# EasyEDA Pro project ProPrj_电赛MSPM0公507扩展板_2026-05-01.epro

# Schematic Schematic1
Board Name: Board1; Create Date: 2025-07-27; Page Name: P1; Project Name: 电赛MSPM0公507扩展板; Schematic Name: Schematic1; Update Date: 2025-11-14; Company: 嘉立创EDA; Page Size: A4; Version: V1.0
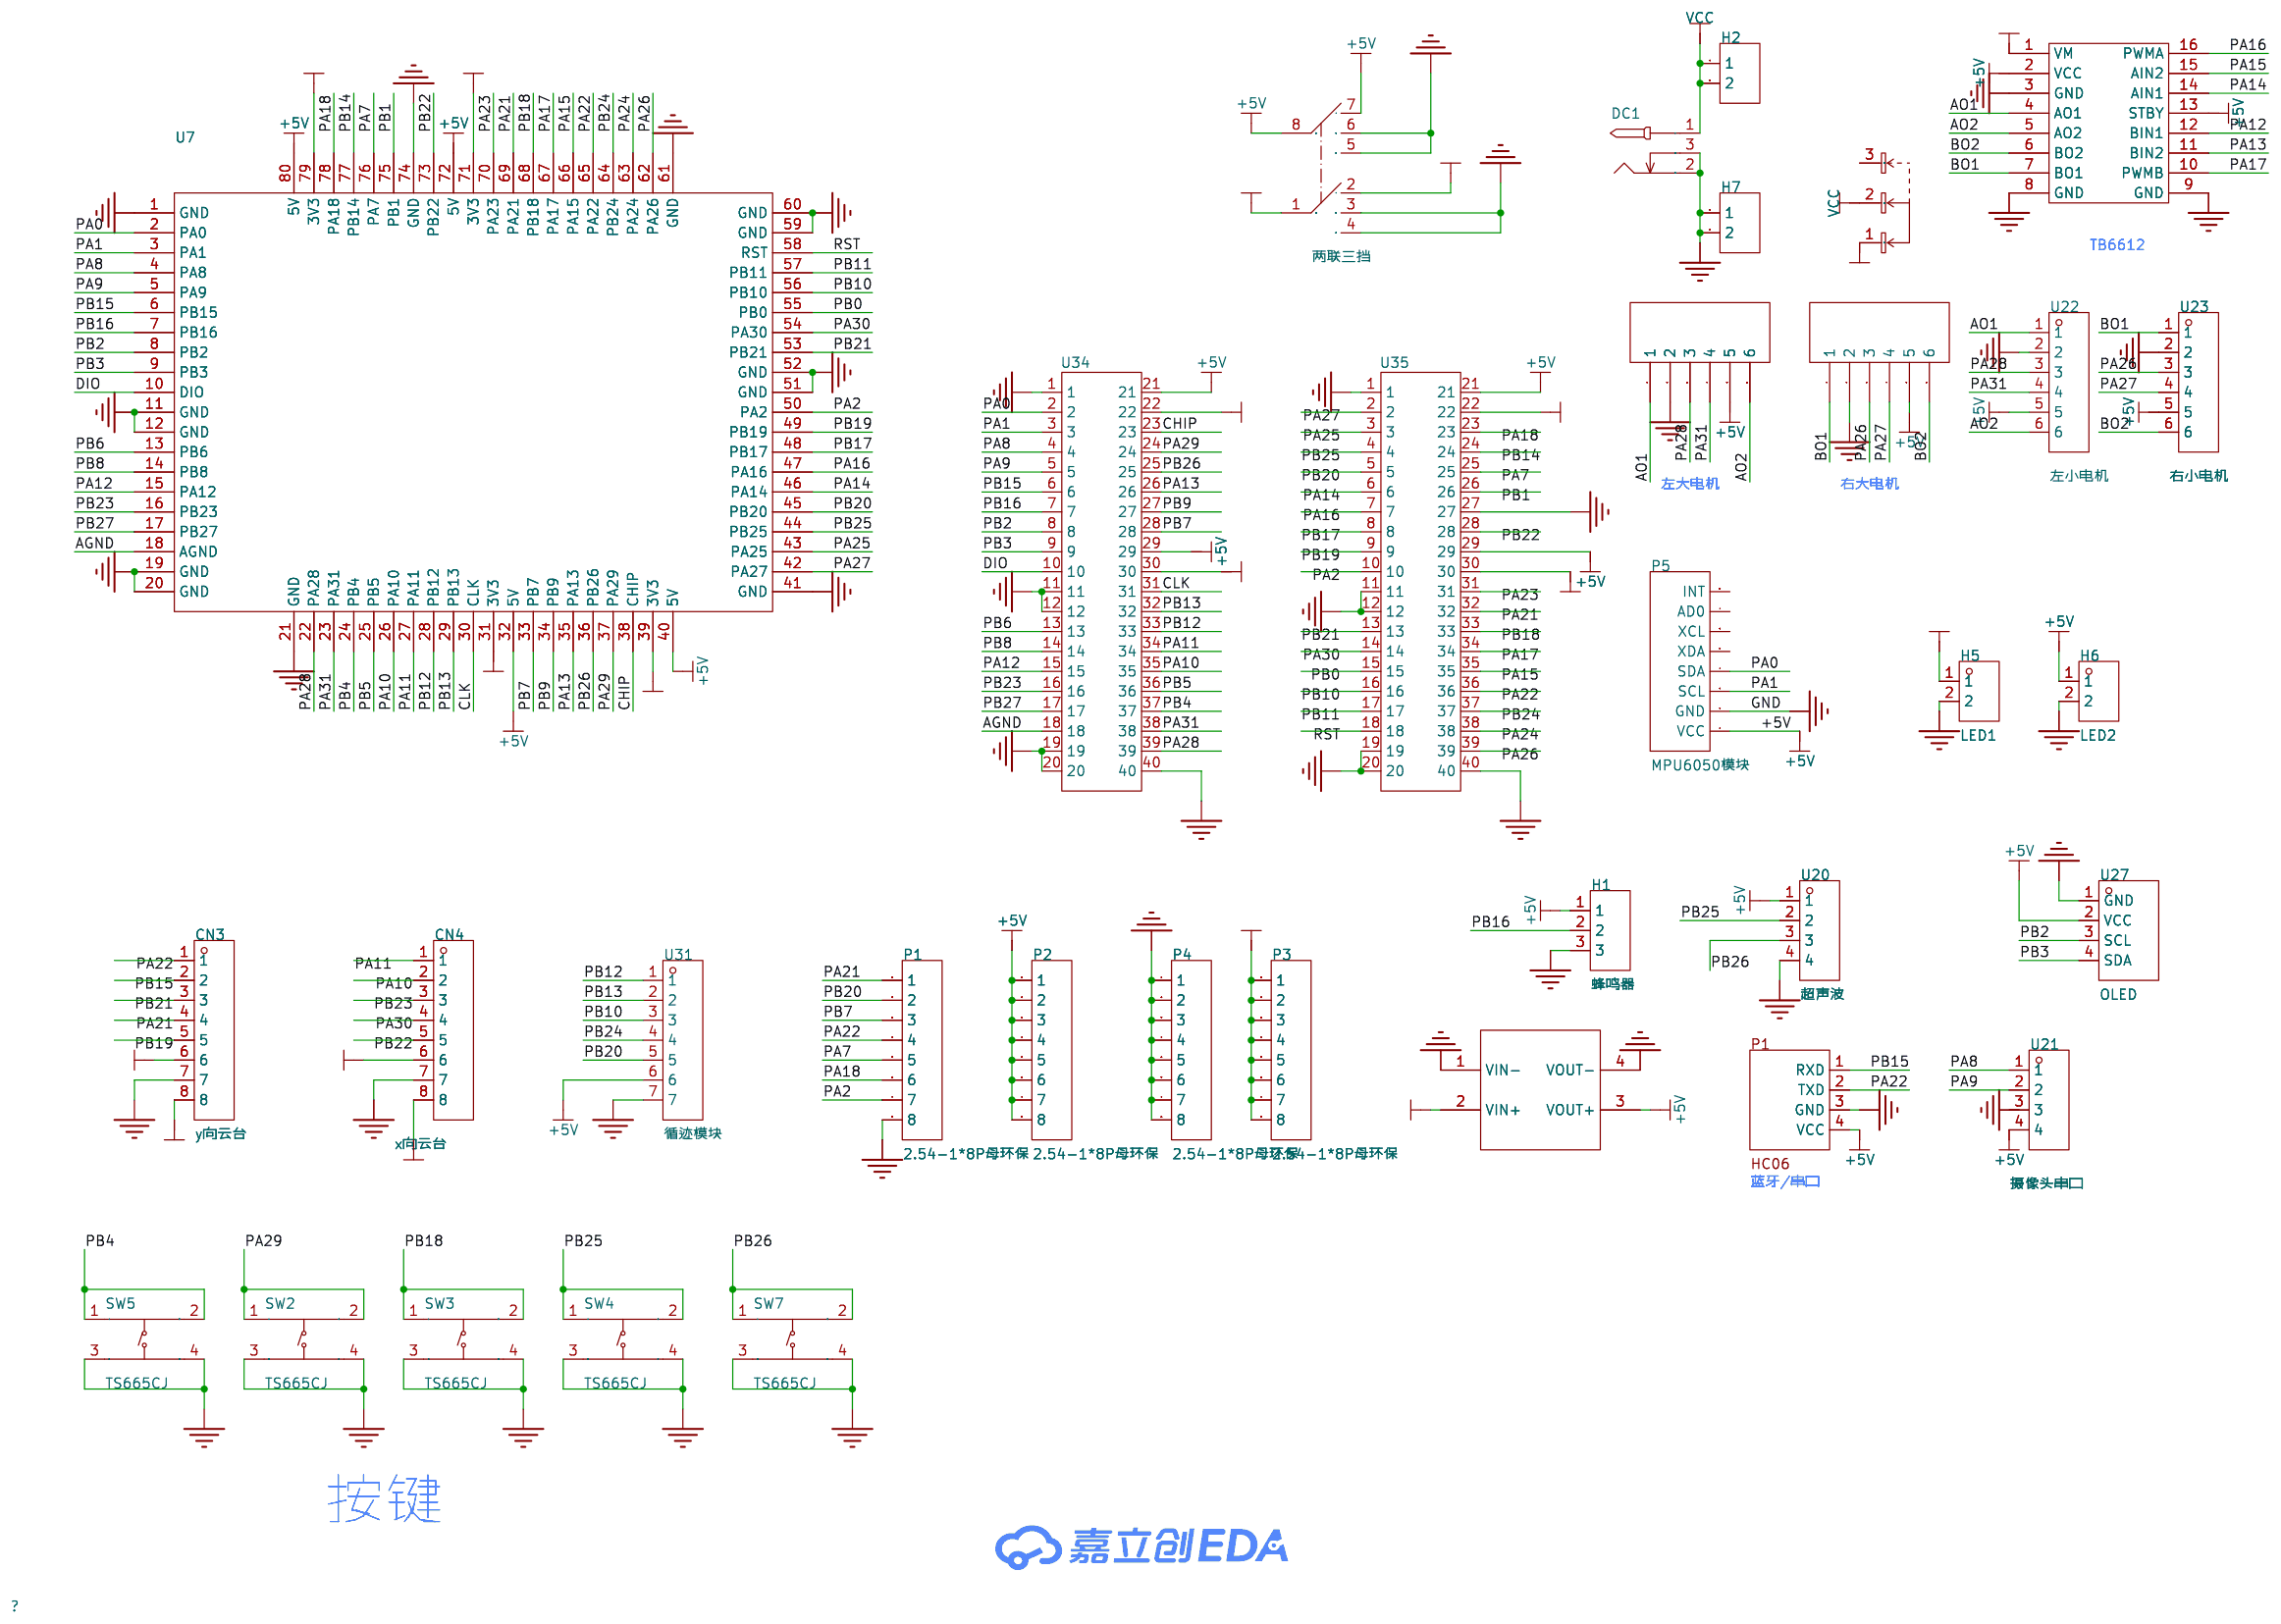
[diagram p0: schematic sheet]

## Parts
CN3  y向云台  [CONN-TH_8P-P2.50-XH2.54-8P]
CN4  x向云台  [CONN-TH_8P-P2.50-XH2.54-8P]
DC1  -  [DC-005_2.5]
H1  蜂鸣器  [HDR-TH_3P-P2.54-V-F]
H2  -  [HDR-TH_2P-P2.54-V-F]
H5  LED1  [HDR-TH_2P-P2.54-V-F]
H6  LED2  [HDR-TH_2P-P2.54-V-F]
H7  -  [HDR-TH_2P-P2.54-V-F]
P1  2.54-1*8P母环保  [HDR-TH_8P-P2.54-V-F-1]
P2  2.54-1*8P母环保  [HDR-TH_8P-P2.54-V-F-1]
P3  2.54-1*8P母环保  [HDR-TH_8P-P2.54-V-F-1]
P4  2.54-1*8P母环保  [HDR-TH_8P-P2.54-V-F-1]
P5  MPU6050模块  [MPU6050模块]
SW1  SS-12D06L5  [SW-TH_3P-P4.70_L11.1-W12.7]
SW2  TS665CJ  [SW-TH_4P-L6.0-W6.0-P4.50-LS6.5]
SW3  TS665CJ  [SW-TH_4P-L6.0-W6.0-P4.50-LS6.5]
SW4  TS665CJ  [SW-TH_4P-L6.0-W6.0-P4.50-LS6.5]
SW5  TS665CJ  [SW-TH_4P-L6.0-W6.0-P4.50-LS6.5]
SW7  TS665CJ  [SW-TH_4P-L6.0-W6.0-P4.50-LS6.5]
SW8  两联三挡  [SW-TH_SS-23D07-GXXX]
U2  TB6612  [TB6612模块]
U4  -  [MP1584EN模块_邮票孔]
U7  -  [嘉立创天猛星]
U13  -  [PH2.0-6]
U14  -  [PH2.0-6]
U17  -  [DIP-1X4P2.54（HC-06蓝牙模块）]
U20  超声波  [HDR-TH_4P-P2.54-V-F]
U21  摄像头串口  [HDR-TH_4P-P2.54-V-F]
U22  左小电机  [CONN-TH_ZH1.5-6AW_C2829757]
U23  右小电机  [CONN-TH_ZH1.5-6AW_C2829757]
U27  OLED  [OLED-TH_L27.8-W27.2-P2.54_C9900033791]
U31  循迹模块  [HDR-TH_7P-P2.54-V-F]
U34  -  [20排针]
U35  -  [20排针]

## Library data of the parts
CN3 CN4 = ZX-XH2.54-8PZZ: 插针结构:1x8P;间距:2.5mm;安装方式:直插;参考系列:XH;总PIN数:8P;排数:1;每排PIN数:8;行距:-;额定电流:3A;触头材质:黄铜;触头镀层:锡;工作温度:-25℃~+85℃;; LCSC Part Name: 1x8P 间距:2.5mm 直插 系列:XH; Supplier Part: C7429638; Manufacturer: Megastar(兆星); Supplier Footprint: 插件,P=2.5mm; JLCPCB Part Class: 扩展库; Datasheet: https://item.szlcsc.com/datasheet/ZX-XH2.54-8PZZ/8427555.html; Supplier: LCSC; Pins Structure: 1x8P; Pitch: 2.5mm; Mounting Type: 直插; Reference Series: XH; Number of Pins: 8P; Number of Rows: 1; Number of PINs Per Row: 8; Current Rating: 3A; Contact Material: 黄铜; Contact Plating: 锡; Operating Temperature: -25℃~+85℃; Voltage Rating: 250V; Plastic Material: PA66; Flame Retardant Rating: UL94V-0; Color: 白色; Z-Height of the Board: 7mm; X-Length of Bottom Edge on Board (Spacing Line): 22.5mm; Y-Width of Bottom Edge on Board: 5.9mm
DC1 = DC-005_2.5: Supplier Footprint: 插件
H1 = PM254V-11-03-H85: 插孔结构:1x3P;间距:2.54mm;行距:-;安装类型:直插;排数:单排;总孔位数:3P;塑高:-;触头材质:黄铜;触头镀层:-;; LCSC Part Name: 间距:2.54mm 1x3P 直插; Supplier Part: C541850; Manufacturer: XFCN(兴飞); Supplier Footprint: 插件,P=2.54mm; JLCPCB Part Class: 扩展库; Datasheet: https://atta.szlcsc.com/upload/public/pdf/source/20200518/C541849_85853D71FC67C51915A806977A588FDA.pdf; Supplier: LCSC; Holes Structure: 1x3P; Pitch: 2.54mm; Mounting Type: 直插; Number of Rows: 单排; Number of Holes: 3P; Contact Material: 黄铜
H2 H7 = HDR-F_2.54_1x2P: Supplier Part: C49661; Supplier Footprint: 插件
H5 H6 = PM254V-11-02-H85: 插孔结构:1x2P;间距:2.54mm;行距:-;安装类型:直插;排数:单排;总孔位数:2P;塑高:-;触头材质:黄铜;触头镀层:-;; LCSC Part Name: 间距:2.54mm 1x2P 直插; Supplier Part: C541849; Manufacturer: XFCN(兴飞); Supplier Footprint: 插件,P=2.54mm; JLCPCB Part Class: 扩展库; Datasheet: https://atta.szlcsc.com/upload/public/pdf/source/20200518/C541849_85853D71FC67C51915A806977A588FDA.pdf; Supplier: LCSC; Holes Structure: 1x2P; Pitch: 2.54mm; Mounting Type: 直插; Number of Rows: 单排; Number of Holes: 2P; Contact Material: 黄铜
P1-P4 = 2.54-1*8P母环保: 排数:单排;总孔位数:8P;间距:2.54mm;插孔结构:1x8P;行距:-;安装类型:直插;塑高:-;触头材质:-;触头镀层:-;; LCSC Part Name: 间距:2.54mm 1x8P 直插; Supplier Part: C27438; Manufacturer: BOOMELE(博穆精密); Supplier Footprint: 插件,P=2.54mm; JLCPCB Part Class: 扩展库; Datasheet: https://atta.szlcsc.com/upload/public/pdf/source/20210301/C2718488_F4427B881E42CAA8DDB0B1C12B3A522C.pdf; Supplier: LCSC; Number of Rows: 单排; Number of Holes: 8P; Pitch: 2.54mm; Holes Structure: 1x8P; Mounting Type: 直插
P5 = MPU6050模块: _: 3
SW1 = SS-12D06L5: 电路结构:单刀双掷;安装方式:侧插;开关颜色:黑色;额定电流(DC):3A;额定电压(DC):250V;额定电流(AC):3A;额定电压(AC):250V;机械寿命:1万次;; LCSC Part Name: 柄长5mm 卧插双档 滑动开关; Supplier Part: C319015; Manufacturer: XKB Connectivity(中国星坤); Supplier Footprint: 插件; JLCPCB Part Class: 扩展库; Datasheet: https://atta.szlcsc.com/upload/public/pdf/source/20211009/0D67854FD60FB1F6FE75130AD47C052C.pdf; Supplier: LCSC; Circuit: 单刀双掷; Actuator Style: 矩形柱状; Pin Style: PC引脚; Switch Length: 12.95mm; Switch Width: 6.6mm; Switch Height: 6.3mm; Mounting Style: 侧插; Actuator Color: 黑色; Current Rating (DC): 3A; Voltage Rating (DC): 250V; Current Rating (AC): 3A; Voltage Rating (AC): 250V; Mechanical Life: 1万次; Operating Temperature: -40℃~+85℃
SW2-SW5 SW7 = TS665CJ: 电路结构:单刀单掷;按钮形状:圆形按钮;安装方式:直插;开关长度:6mm;开关宽度:6mm;开关高度:5mm;触点电流:50mA;额定电压(DC):12V;带灯:-;机械寿命:-;; LCSC Part Name: 6*6*5mm 直插 轻触开关; Supplier Part: C393938; Manufacturer: SHOU HAN(首韩); Supplier Footprint: 插件; JLCPCB Part Class: 扩展库; Datasheet: https://atta.szlcsc.com/upload/public/pdf/source/20190521/C393938_BDABEAC600B4C55E200A80AA129B70BC.pdf; Supplier: LCSC; Circuit: 单刀单掷; Actuator Style: 圆形按钮; Mounting Style: 直插; Switch Length: 6mm; Switch Width: 6mm; Switch Height: 5mm; Contact Current: 50mA; Voltage Rating (DC): 12V
SW8 = 双刀三掷开关: SS-23D07-G060 / 电路结构:双刀三掷;安装方式:直插;开关颜色:黑色;额定电流(DC):1A; / 额定电压(DC):24V;机械寿命:1万次;; LCSC Part Name: 柄长6mm 直插三档 滑动开关; Supplier Part: C2876026; Manufacturer: G-Switch(品赞); Supplier Footprint: 插件; JLCPCB Part Class: 扩展库; Datasheet: https://atta.szlcsc.com/upload/public/pdf/source/20210810/D61593AB5453652CDE8C7ACF23E1586D.pdf; Supplier: LCSC; Circuit: 双刀三掷; Actuator Style: 矩形柱状; Pin Style: PC引脚; Switch Length: 12.7mm; Switch Width: 7.1mm; Switch Height: 10.7mm; Mounting Style: 直插; Actuator Color: 黑色; Current Rating (DC): 1A; Voltage Rating (DC): 24V; Mechanical Life: 1万次; Operating Temperature: -25℃~+70℃
U2 = TB6612模块
U4 = MP1584EN模块: MP1584END电源模块
U7 = 立创天猛星-MSPM0G3507
U13 U14 = PH2.0-6: _: 3
U17 = HC06
U20 U21 = ZX-PM2.54-1-4PY: 插孔结构:1x4P;间距:2.54mm;行距:-;圆孔/方孔:方孔;安装方式:直插;排数:单排;总孔位数:4P;额定电流:3A;额定电压:-;插孔方向:顶部;塑高:8.5mm;触头材质:-;触头镀层:金;工作温度:-40℃~+105℃;; LCSC Part Name: 1x4P 间距:2.54mm 直插; Supplier Part: C7499324; Manufacturer: Megastar(兆星); Supplier Footprint: 插件,P=2.54mm; JLCPCB Part Class: 扩展库; Datasheet: https://atta.szlcsc.com/upload/public/pdf/source/20231122/7B8A8052B709698EED6259902C1E0188.pdf; Supplier: LCSC; Holes Structure: 1x4P; Pitch: 2.54mm; Circular Hole / Square Hole: 方孔; Mounting Type: 直插; Number of Rows: 单排; Number of Positions: 4P; Current Rating: 3A; Holes Direction: 顶部; Insulation Height: 8.5mm; Contact Plating: 金; Operating Temperature: -40℃~+105℃; PIN Length: 3.2mm
U22 U23 = BX-ZH1.5-6PWZ: 插针结构:1x6P;间距:1.5mm;安装方式:弯插;参考系列:ZH;总PIN数:6P;排数:1;每排PIN数:6;行距:-;额定电流:-;触头材质:黄铜;触头镀层:锡;工作温度:-25℃~+85℃;; LCSC Part Name: 1x6P 间距:1.5mm 弯插 系列:ZH; Supplier Part: C18077740; Manufacturer: Bossie(博锡); Supplier Footprint: 弯插,P=1.5mm; JLCPCB Part Class: 扩展库; Datasheet: https://atta.szlcsc.com/upload/public/pdf/source/20231017/5A4E9FE20877BDD2F3FB1D1F8B5EF450.pdf; Supplier: LCSC; Pins Structure: 1x6P; Pitch: 1.5mm; Mounting Type: 弯插; Reference Series: ZH; Number of Pins: 6P; Number of Rows: 1; Number of PINs Per Row: 6; Contact Material: 黄铜; Contact Plating: 锡; Operating Temperature: -25℃~+85℃; Voltage Rating: 250V; Plastic Material: PA66; Color: 白色; Z-Height of the Board: 3.7mm; X-Length of Bottom Edge on Board (Spacing Line): 10.5mm; Y-Width of Bottom Edge on Board: 4.55mm
U27 = HS96L03W2C03: 主控芯片:SSD1315;接口类型:I2C;尺寸(inch):0.96;像素分辨率:128x64;; LCSC Part Name: 0.96寸OLED显示屏窄白光IIC; Supplier Part: C5248080; Manufacturer: HS(汉昇); JLCPCB Part Class: 扩展库; Datasheet: https://atta.szlcsc.com/upload/public/pdf/source/20230627/763D01F79A90007632F098068C7C8AD9.pdf; Supplier: LCSC; Main Control Chip: SSD1315; Interface Type: I2C; Size: 0.96; Pixel Resolution: 128x64; Operating Temperature: -40℃~+70℃
U31 = KH-2.54FH-1X7P-H8.5: 插孔结构:1x7P;间距:2.54mm;行距:-;圆孔/方孔:方孔;安装方式:直插;排数:单排;总孔位数:7P;额定电流:3A;额定电压:-;插孔方向:顶部;塑高:8.5mm;工作温度:-40℃~+105℃;; LCSC Part Name: 间距:2.54mm 1x7P 直插; Supplier Part: C2932672; Manufacturer: kinghelm(金航标); Supplier Footprint: 插件,P=2.54mm; JLCPCB Part Class: 扩展库; Datasheet: https://item.szlcsc.com/datasheet/KH-2.54FH-1X7P-H8.5/3278193.html; Supplier: LCSC; Holes Structure: 1x7P; Pitch: 2.54mm; Circular Hole / Square Hole: 方孔; Mounting Type: 直插; Number of Rows: 单排; Number of Positions: 7P; Current Rating: 3A; Holes Direction: 顶部; Insulation Height: 8.5mm; Operating Temperature: -40℃~+105℃
U34 U35 = 20排针

## Nets
+3.3V: CN3.6 CN4.6 H5.1 U7.31(3V3) U7.39(3V3) U7.71(3V3) U7.79(3V3) U34.22 U34.30 U35.22 U35.30
+5V: H1.1 H6.1 P2.1 P2.2 P2.3 P2.4 P2.5 P2.6 P2.7 P2.8 P5.1(VCC) SW8.7 SW8.8 U2.2(VCC) U2.13(STBY) U4.3(VOUT+) U7.32(5V) U7.40(5V) U7.72(5V) U7.80(5V) U13.5 U14.5 U17.4(VCC) U20.1 U21.4 U22.5 U23.5 U27.2(VCC) U31.6 U34.21 U34.29 U35.21 U35.29
+12V: CN3.8 CN4.8 P3.1 P3.2 P3.3 P3.4 P3.5 P3.6 P3.7 P3.8 SW1.1 SW8.1(8) SW8.2(7) U2.1(VM) U4.2(VIN+)
AGND: U7.18(AGND) U34.18
GND: CN3.7 CN4.7 DC1.2 DC1.3 H1.3 H5.2 H6.2 H7.1 H7.2 P1.8 P4.1 P4.2 P4.3 P4.4 P4.5 P4.6 P4.7 P4.8 P5.2(GND) SW2.3(C) SW2.4(D) SW3.3(C) SW3.4(D) SW4.3(C) SW4.4(D) SW5.3(C) SW5.4(D) SW7.3(C) SW7.4(D) SW8.3(6) SW8.4(5) SW8.5 SW8.6 U2.3(GND) U2.8(GND) U2.9(GND) U4.1(VIN-) U4.4(VOUT-) U7.1(GND) U7.11(GND) U7.12(GND) U7.19(GND) U7.20(GND) U7.21(GND) U7.41(GND) U7.51(GND) U7.52(GND) U7.59(GND) U7.60(GND) U7.61(GND) U7.74(GND) U13.2 U14.2 U17.3(GND) U20.4 U21.3 U22.2 U23.2 U27.1(GND) U31.7 U34.1 U34.11 U34.12 U34.19 U34.20 U34.40 U35.1 U35.11 U35.12 U35.19 U35.20 U35.27 U35.40
VCC: DC1.1(4) H2.1 H2.2 SW1.2
AO1: U2.4(AO1) U13.1 U22.1
AO2: U2.5(AO2) U13.6 U22.6
BO1: U2.7(BO1) U14.1 U23.1
BO2: U2.6(BO2) U14.6 U23.6
CHIP: U7.38(CHIP) U34.23
CLK: U7.30(CLK) U34.31
DIO: U7.10(DIO) U34.10
PA0: P5.4(SDA) U7.2(PA0) U34.2
PA1: P5.3(SCL) U7.3(PA1) U34.3
PA2: P1.7 U7.50(PA2) U35.10
PA7: P1.5 U7.76(PA7) U35.25
PA8: U7.4(PA8) U21.1 U34.4
PA9: U7.5(PA9) U21.2 U34.5
PA10: CN4.2 U7.26(PA10) U34.35
PA11: CN4.1 U7.27(PA11) U34.34
PA12: U2.12(BIN1) U7.15(PA12) U34.15
PA13: U2.11(BIN2) U7.35(PA13) U34.26
PA14: U2.14(AIN1) U7.46(PA14) U35.6
PA15: U2.15(AIN2) U7.66(PA15) U35.35
PA16: U2.16(PWMA) U7.47(PA16) U35.7
PA17: U2.10(PWMB) U7.67(PA17) U35.34
PA18: P1.6 U7.78(PA18) U35.23
PA21: CN3.4 P1.1 U7.69(PA21) U35.32
PA22: CN3.1 P1.4 U7.65(PA22) U17.2(TXD) U35.36
PA23: U7.70(PA23) U35.31
PA24: U7.63(PA24) U35.38
PA25: U7.43(PA25) U35.3
PA26: U7.62(PA26) U14.3 U23.3 U35.39
PA27: U7.42(PA27) U14.4 U23.4 U35.2
PA28: U7.22(PA28) U13.3 U22.3 U34.39
PA29: SW2.1(A) SW2.2(B) U7.37(PA29) U34.24
PA30: CN4.4 U7.54(PA30) U35.14
PA31: U7.23(PA31) U13.4 U22.4 U34.38
PB0: U7.55(PB0) U35.15
PB1: U7.75(PB1) U35.26
PB2: U7.8(PB2) U27.3(SCL) U34.8
PB3: U7.9(PB3) U27.4(SDA) U34.9
PB4: SW5.1(A) SW5.2(B) U7.24(PB4) U34.37
PB5: U7.25(PB5) U34.36
PB6: U7.13(PB6) U34.13
PB7: P1.3 U7.33(PB7) U34.28
PB8: U7.14(PB8) U34.14
PB9: U7.34(PB9) U34.27
PB10: U7.56(PB10) U31.3 U35.16
PB11: U7.57(PB11) U35.17
PB12: U7.28(PB12) U31.1 U34.33
PB13: U7.29(PB13) U31.2 U34.32
PB14: U7.77(PB14) U35.24
PB15: CN3.2 U7.6(PB15) U17.1(RXD) U34.6
PB16: H1.2 U7.7(PB16) U34.7
PB17: U7.48(PB17) U35.8
PB18: SW3.1(A) SW3.2(B) U7.68(PB18) U35.33
PB19: CN3.5 U7.49(PB19) U35.9
PB20: P1.2 U7.45(PB20) U31.5 U35.5
PB21: CN3.3 U7.53(PB21) U35.13
PB22: CN4.5 U7.73(PB22) U35.28
PB23: CN4.3 U7.16(PB23) U34.16
PB24: U7.64(PB24) U31.4 U35.37
PB25: SW4.1(A) SW4.2(B) U7.44(PB25) U20.2 U35.4
PB26: SW7.1(A) SW7.2(B) U7.36(PB26) U20.3 U34.25
PB27: U7.17(PB27) U34.17
RST: U7.58(RST) U35.18

Not connected (* = marked no-connect by the designer): P5 5(XDA) 6(XCL) 7(AD0) 8(INT); SW1 3

## Notes on the sheet
- TB6612
- 左大电机
- 右大电机
- 蓝牙/串口
- 按键

# Board PCB1
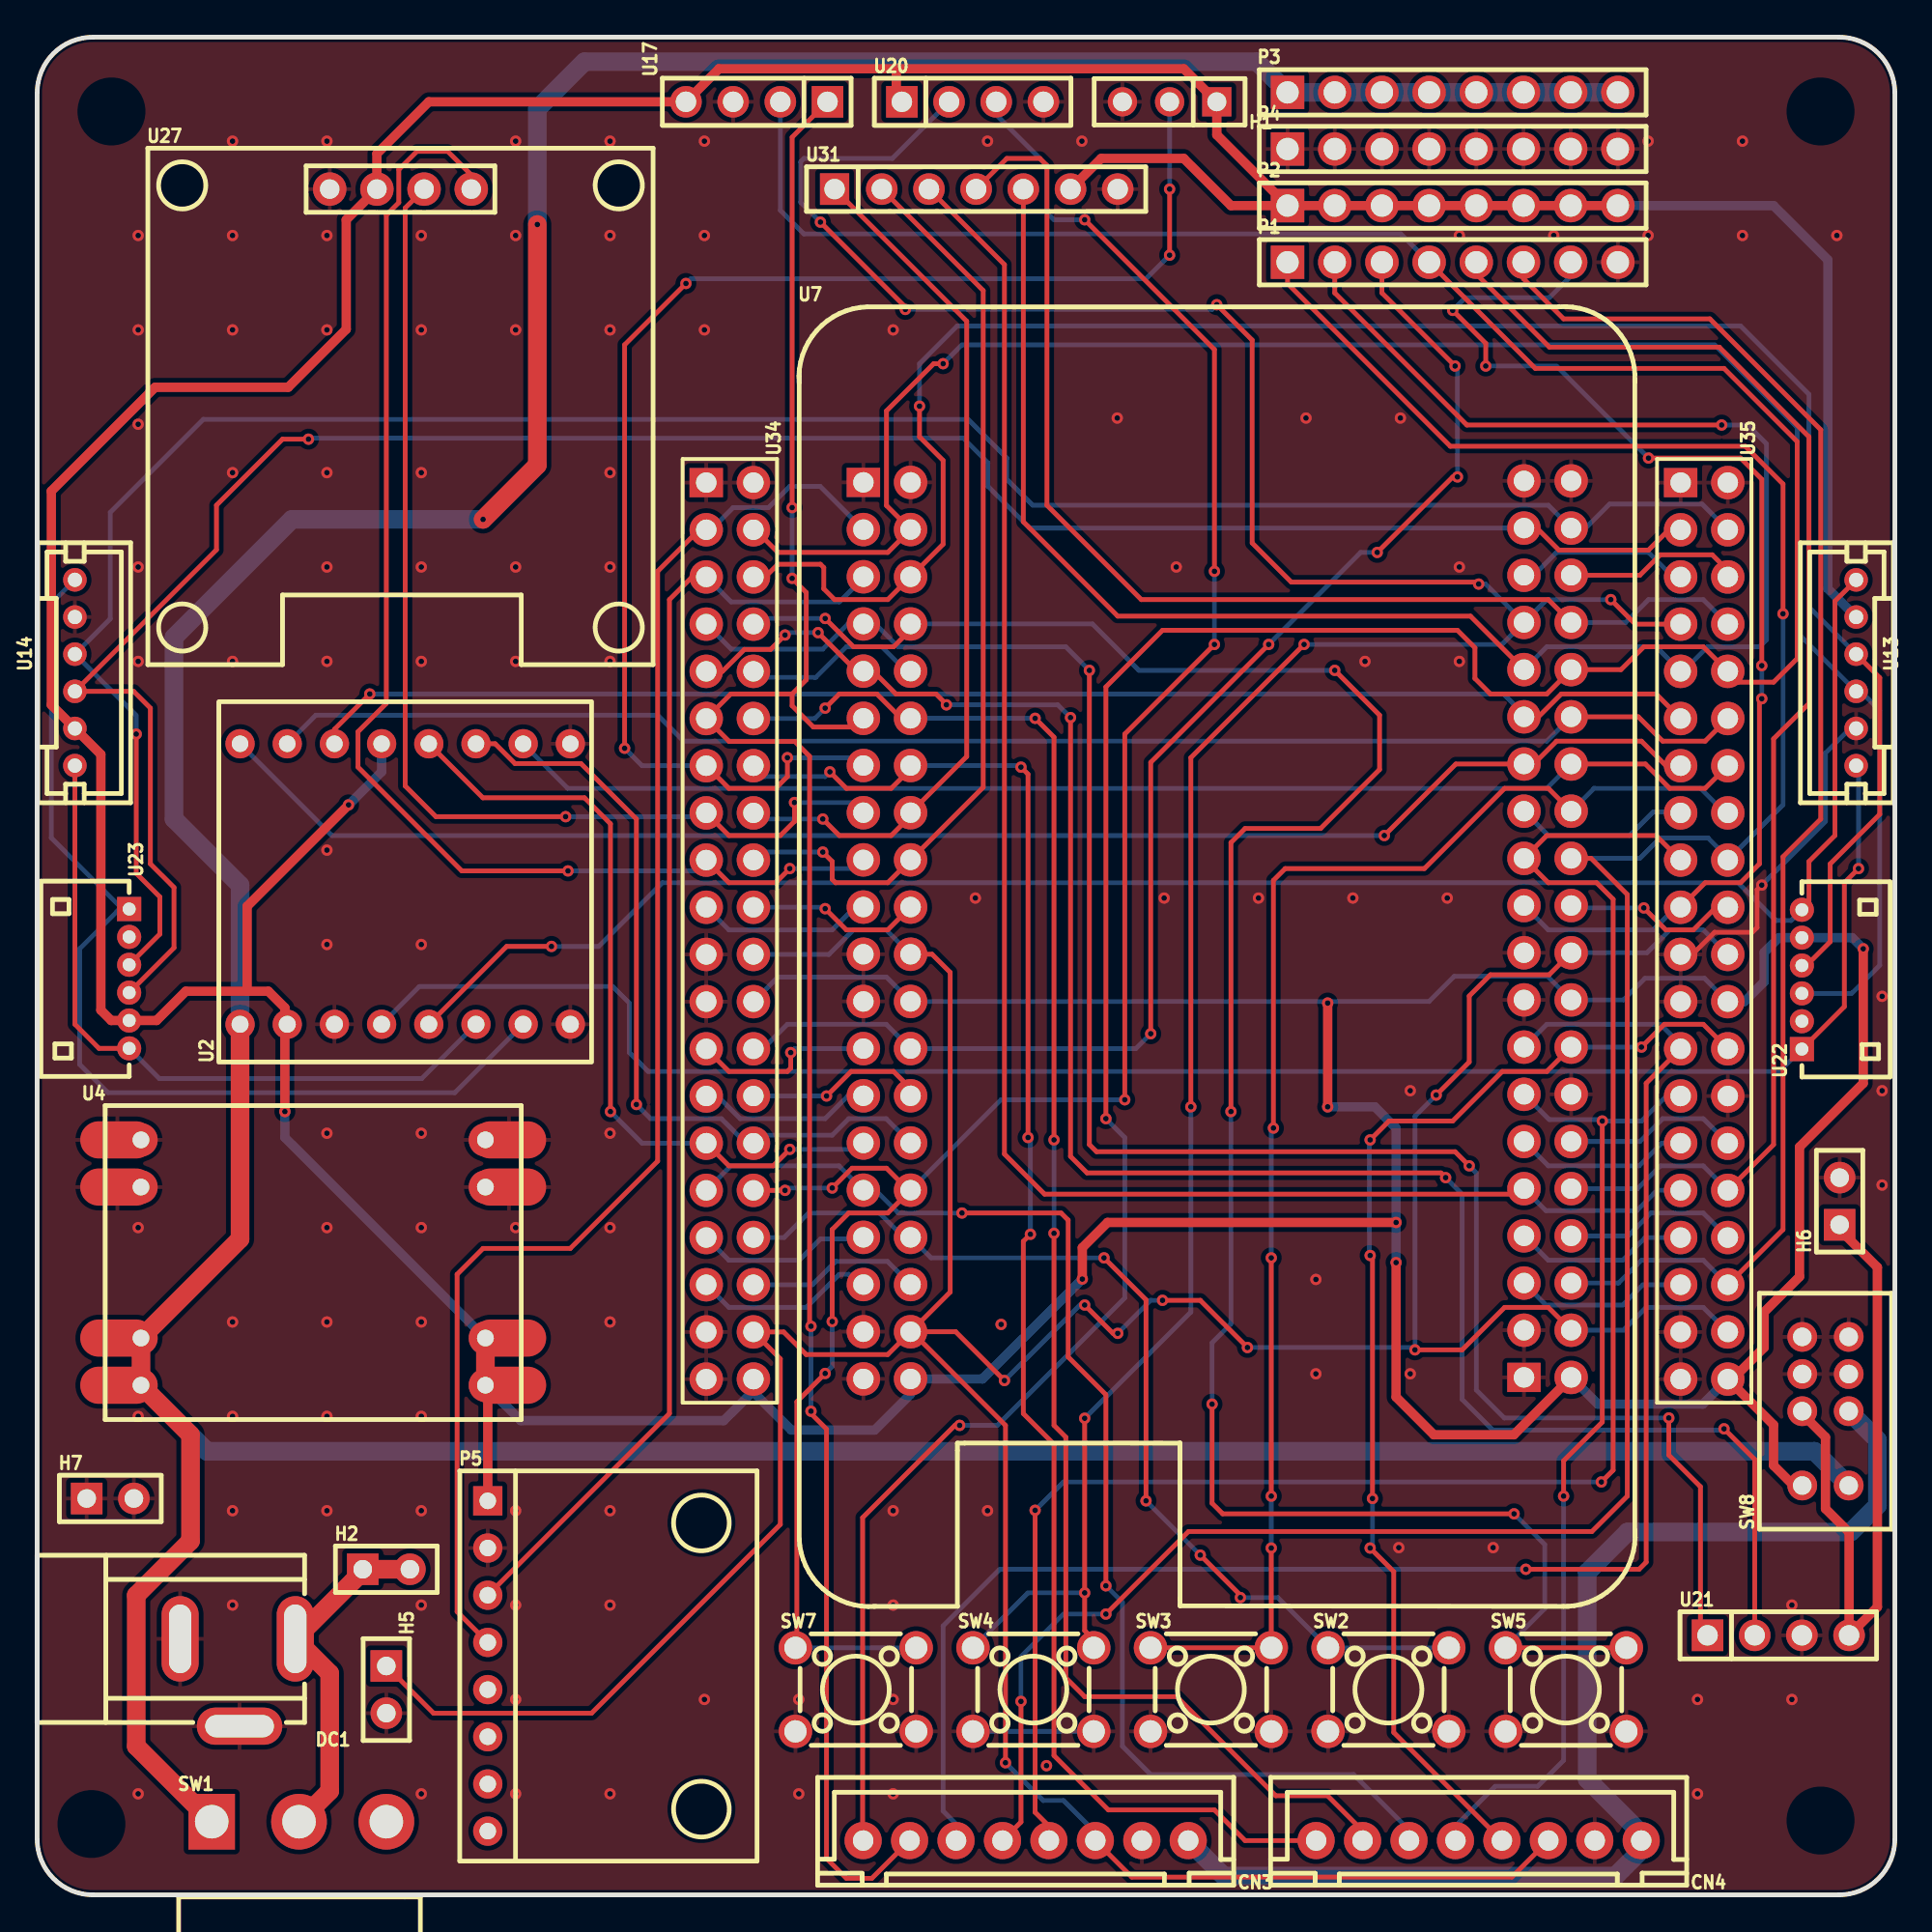
[diagram p1: board, top side]
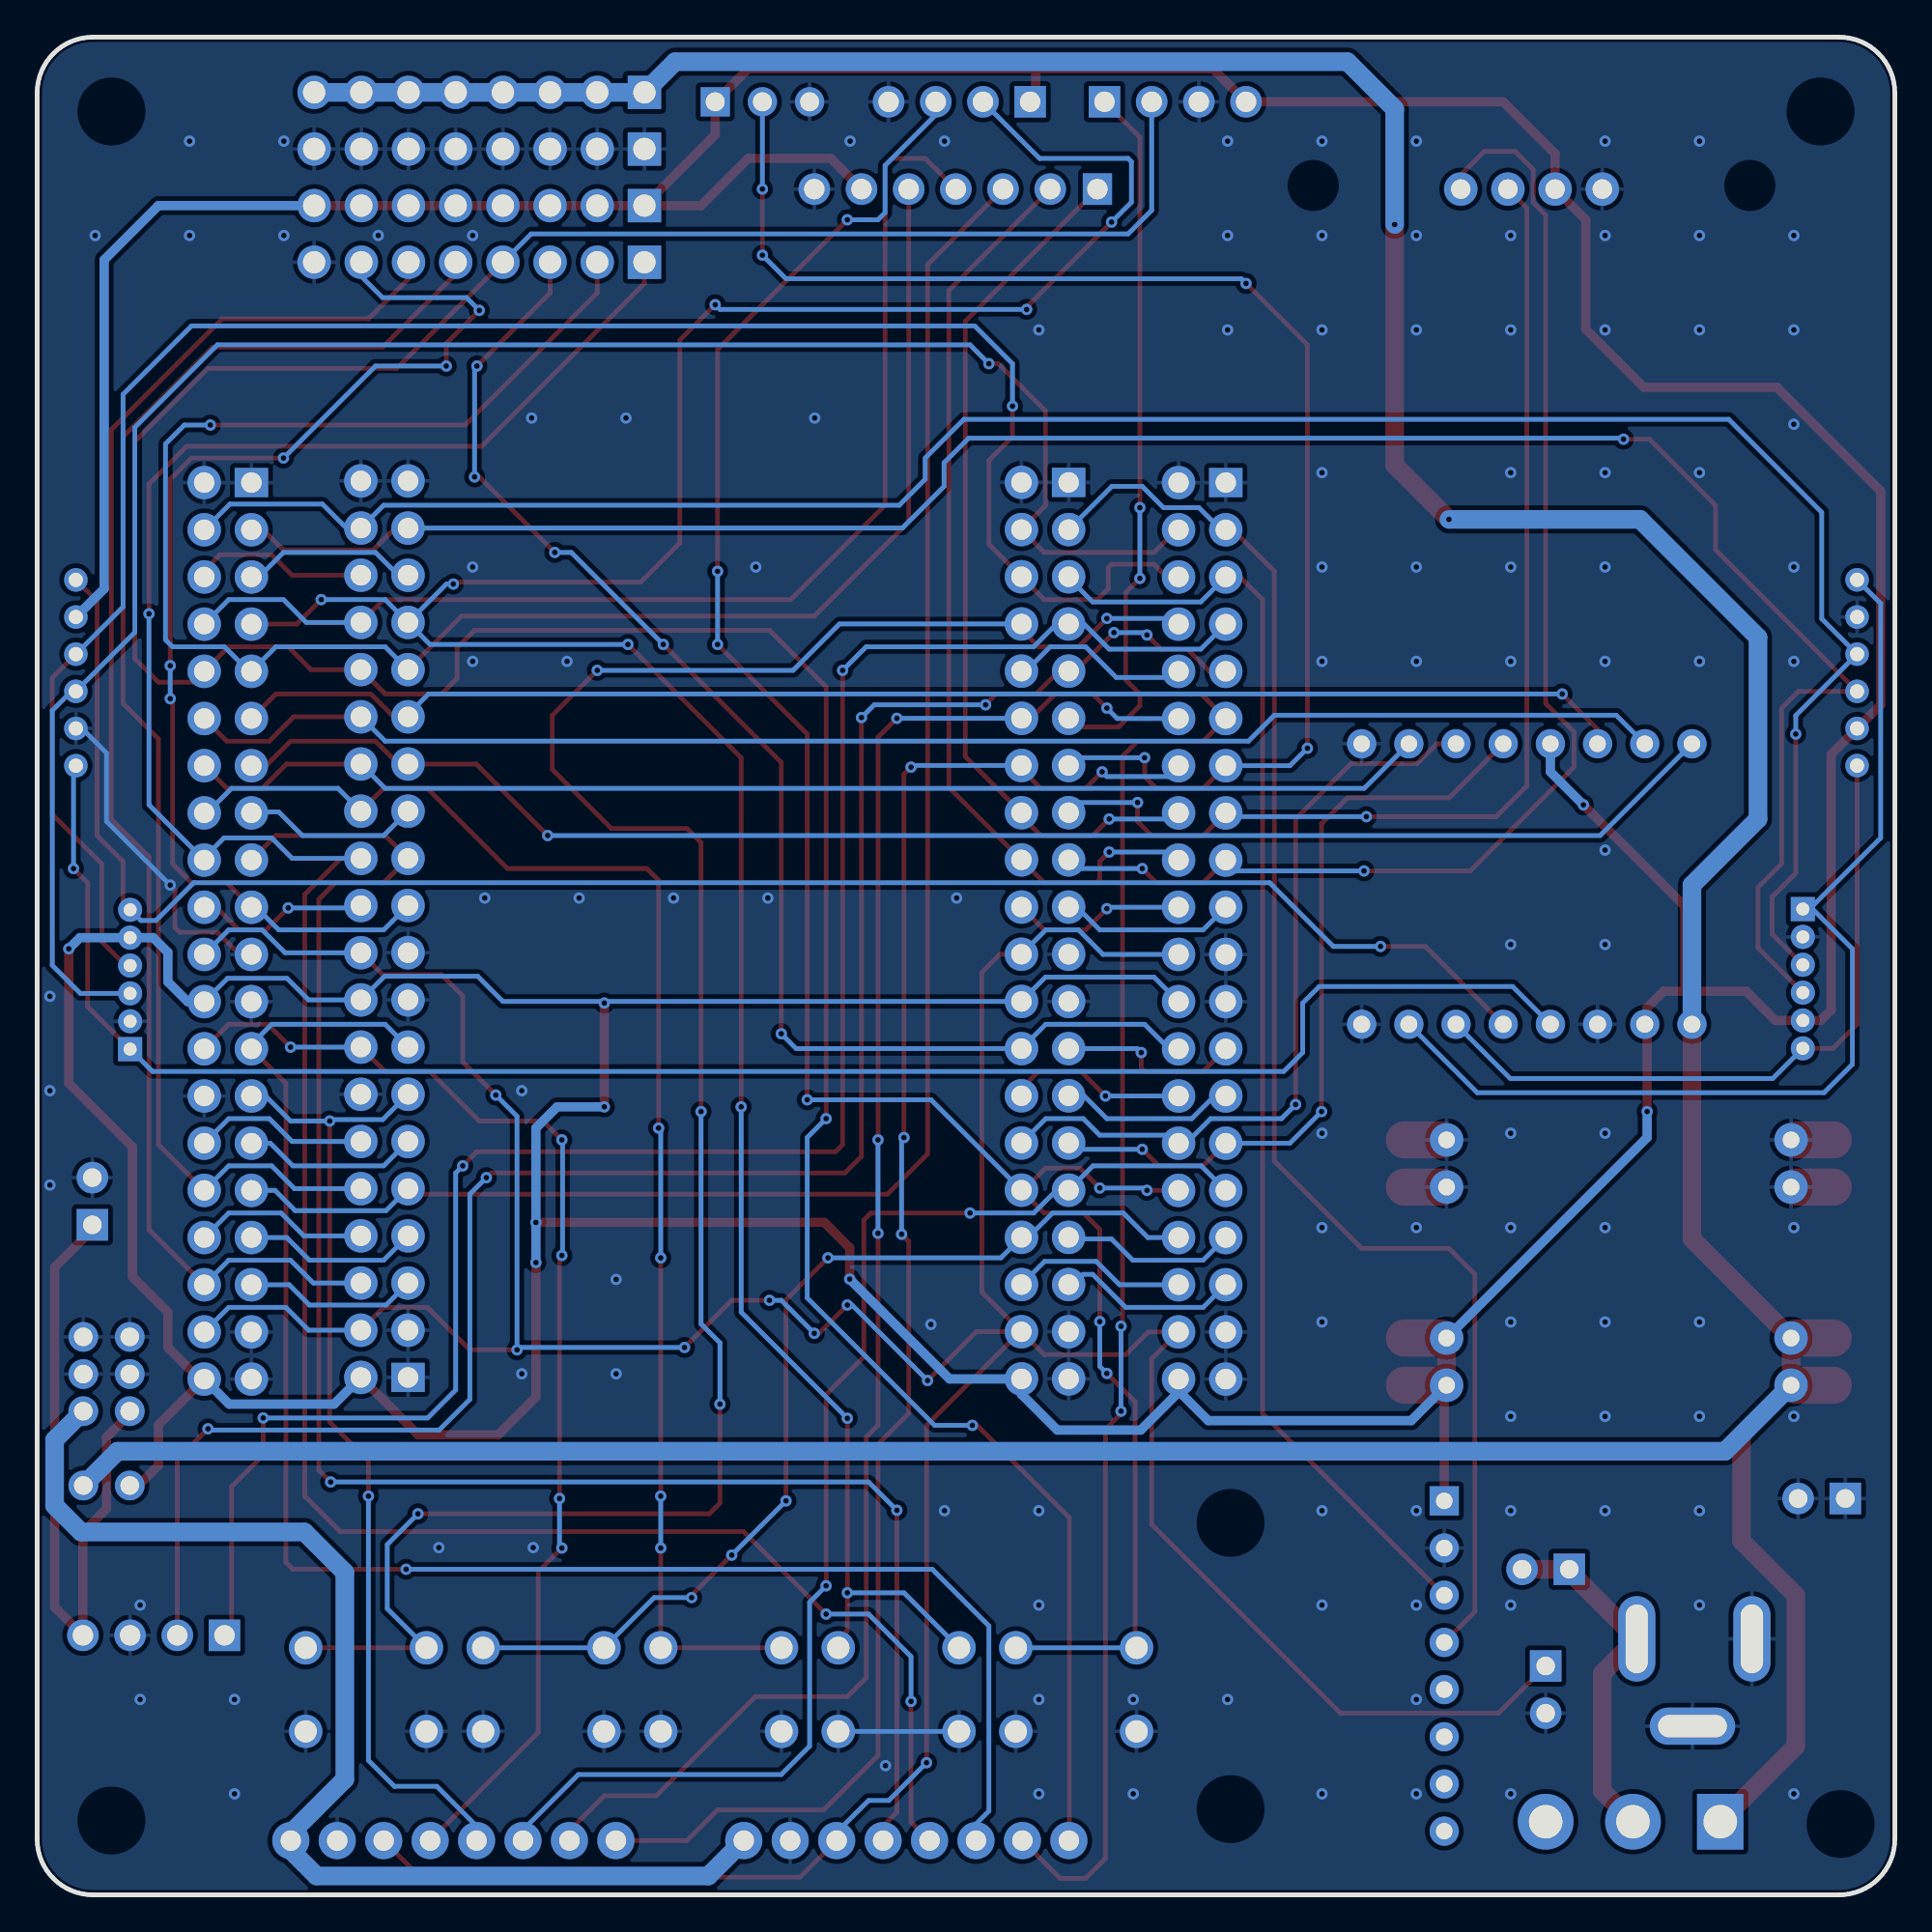
[diagram p2: board, bottom side, seen from below]

Outline 100 x 100 mm; copper layers: Top Layer, Bottom Layer. Coordinates in mm from the lower left corner of the outline.
Outline path: 0,97 0,3 arc(0.88,0.88) 3,0 97,0 arc(99.12,0.88) 100,3 100,97 arc(99.12,99.12) 97,100 3,100 arc(0.88,99.12) 0,97
Stack: Top Layer 0.035mm / Dielectric1 1.51mm FR4 er 4.5 / Bottom Layer 0.035mm

## Design rules (mm)
template: JLCPCB Capability(Two Layers Board)
spacing copperThickness1oz (default): track to track 0.102, other pairs 0.152 to 0.3
spacing copperThickness2oz: track to track 0.203, other pairs 0.152 to 0.3
track width copperThickness1oz (default): min 0.127, default 0.254, max 2.54
track width copperThickness2oz: min 0.203, default 0.254, max 2.54
differential pair differentialPair (default): width min 0.127, default 0.254, max 2.54; gap min 0.152, default 0.152
via viaSize (default): diameter min 0.5, default 0.61, max 10; hole min 0.3, default 0.305, max 6.3

## Placement (name value [footprint] x y rotation side)
CN3  y向云台  [CONN-TH_8P-P2.50-XH2.54-8P]  53.21 2.92 180 top
CN4  x向云台  [CONN-TH_8P-P2.50-XH2.54-8P]  77.6 2.92 180 top
DC1  -  [DC-005_2.5]  10.67 13.46 180 top
H1  蜂鸣器  [HDR-TH_3P-P2.54-V-F]  60.96 96.52 180 top
H2  -  [HDR-TH_2P-P2.54-V-F]  18.8 17.53 0 top
H5  LED1  [HDR-TH_2P-P2.54-V-F]  18.8 11.05 270 top
H6  LED2  [HDR-TH_2P-P2.54-V-F]  97.03 37.34 90 top
H7  -  [HDR-TH_2P-P2.54-V-F]  3.94 21.34 0 top
P1  2.54-1*8P母环保  [HDR-TH_8P-P2.54-V-F-1]  76.2 87.88 0 top
P2  2.54-1*8P母环保  [HDR-TH_8P-P2.54-V-F-1]  76.2 90.93 0 top
P3  2.54-1*8P母环保  [HDR-TH_8P-P2.54-V-F-1]  76.2 97.03 0 top
P4  2.54-1*8P母环保  [HDR-TH_8P-P2.54-V-F-1]  76.2 93.98 0 top
P5  -  [MPU6050模块]  24.26 3.43 0 top
SW1  SS-12D06L5  [SW-TH_3P-P4.70_L11.1-W12.7]  14.1 3.94 0 top
SW2  TS665CJ  [SW-TH_4P-L6.0-W6.0-P4.50-LS6.5]  72.74 11.05 0 top
SW3  TS665CJ  [SW-TH_4P-L6.0-W6.0-P4.50-LS6.5]  63.18 11.05 0 top
SW4  TS665CJ  [SW-TH_4P-L6.0-W6.0-P4.50-LS6.5]  53.63 11.05 0 top
SW5  TS665CJ  [SW-TH_4P-L6.0-W6.0-P4.50-LS6.5]  82.3 11.05 0 top
SW7  TS665CJ  [SW-TH_4P-L6.0-W6.0-P4.50-LS6.5]  44.07 11.05 0 top
SW8  两联三挡  [SW-TH_SS-23D07-GXXX]  96.27 26.03 90 top
U2  TB6612  [TB6612模块]  28.7 46.86 90 top
U4  -  [MP1584EN模块_邮票孔]  14.1 34.54 0 top
U7  -  [嘉立创天猛星]  63.66 51.94 0 top
U13  -  [PH2.0-6]  97.92 65.79 270 top
U14  -  [PH2.0-6]  2.03 65.79 90 top
U17  -  [DIP-1X4P2.54（HC-06蓝牙模块）]  38.74 96.52 90 top
U20  超声波  [HDR-TH_4P-P2.54-V-F]  50.36 96.52 0 top
U21  摄像头串口  [HDR-TH_4P-P2.54-V-F]  93.73 13.97 0 top
U22  左小电机  [CONN-TH_ZH1.5-6AW_C2829757]  95 49.28 90 top
U23  右小电机  [CONN-TH_ZH1.5-6AW_C2829757]  4.95 49.32 270 top
U27  OLED  [OLED-TH_L27.8-W27.2-P2.54_C9900033791]  19.56 91.82 0 top
U31  循迹模块  [HDR-TH_7P-P2.54-V-F]  50.55 91.82 0 top
U34  -  [20排针]  81.91 99.95 270 top
U35  -  [20排针]  134.37 99.95 270 top

## Footprints (pads in the part's own frame, mm; a bottom-side part is the same pattern mirrored in y, then rotated)
20排针
  rect 1.575x1.8 hole 1.1: 1(23.927,-45.898)
  round 1.8 hole 1.1: 2(26.467,-45.898) 3(29.007,-45.898) 4(31.547,-45.898) 5(34.087,-45.898) 6(36.627,-45.898) 7(39.167,-45.898) 8(41.707,-45.898) 9(44.247,-45.898) 10(46.787,-45.898) 11(49.327,-45.898) 12(51.867,-45.898) 13(54.407,-45.898) 14(56.947,-45.898) 15(59.487,-45.898) 16(62.027,-45.898) 17(64.567,-45.898) 18(67.107,-45.898) 19(69.647,-45.898) 20(72.187,-45.898) 21(72.187,-43.358) 22(69.647,-43.358) 23(67.107,-43.358) 24(64.567,-43.358) 25(62.027,-43.358) 26(59.487,-43.358) 27(56.947,-43.358) 28(54.407,-43.358) 29(51.867,-43.358) 30(49.327,-43.358) 31(46.787,-43.358) 32(44.247,-43.358) 33(41.707,-43.358) 34(39.167,-43.358) 35(36.627,-43.358) 36(34.087,-43.358) 37(31.547,-43.358) 38(29.007,-43.358) 39(26.467,-43.358) 40(23.927,-43.358)
CONN-TH_8P-P2.50-XH2.54-8P
  round 2 hole 1.1: 1(8.75,0) 2(6.25,0) 3(3.75,0) 4(1.25,0) 5(-1.25,0) 6(-3.75,0) 7(-6.25,0) 8(-8.75,0)
CONN-TH_ZH1.5-6AW_C2829757
  rect 1.3x1.3 hole 0.7: 1(-3.75,0)
  round 1.3 hole 0.7: 2(-2.25,0) 3(-0.75,0) 4(0.75,0) 5(2.25,0) 6(3.75,0)
DC-005_2.5
  oval 2x4.6 hole 1.2x3.7: 1(-3.227,-0.318) 2(2.973,-0.318)
  oval 4.6x2 hole 3.7x1.2: 3(-0.227,4.382)
DIP-1X4P2.54（HC-06蓝牙模块）
  rect 1.7x1.7 hole 1.1: 1(0,-3.81)
  round 1.7 hole 1.1: 2(0,-1.27) 3(0,1.27) 4(0,3.81)
HDR-TH_2P-P2.54-V-F
  rect 1.7x1.7 hole 1: 1(-1.27,0)
  round 1.7 hole 1: 2(1.27,0)
HDR-TH_3P-P2.54-V-F
  rect 1.575x1.575 hole 1.02: 1(-2.54,0)
  round 1.575 hole 1.02: 2(0,0) 3(2.54,0)
HDR-TH_4P-P2.54-V-F
  rect 1.7x1.7 hole 1.1: 1(-3.81,0)
  round 1.7 hole 1.1: 2(-1.27,0) 3(1.27,0) 4(3.81,0)
HDR-TH_7P-P2.54-V-F
  rect 1.575x1.7 hole 1.1: 1(-7.62,0)
  round 1.7 hole 1.1: 2(-5.08,0) 3(-2.54,0) 4(0,0) 5(2.54,0) 6(5.08,0) 7(7.62,0)
HDR-TH_8P-P2.54-V-F-1
  rect 1.8x1.8 hole 1.2: 1(-8.89,0)
  round 1.8 hole 1.2: 2(-6.35,0) 3(-3.81,0) 4(-1.27,0) 5(1.27,0) 6(3.81,0) 7(6.35,0) 8(8.89,0)
MP1584EN模块_邮票孔
  oval 4x2 smd: 1(-9.779,6.096) 1(-9.779,3.556) 2(-9.779,-4.572) 2(-9.779,-7.112) 3(11.303,-4.572) 3(11.303,-7.112) 4(11.303,6.096) 4(11.303,3.556)
  round 1.8 hole 0.9: 1(-8.509,6.096) 1(-8.509,3.556) 2(-8.509,-4.572) 2(-8.509,-7.112) 3(10.033,-4.572) 3(10.033,-7.112) 4(10.033,6.096) 4(10.033,3.556)
MPU6050模块
  rect 1.575x1.575 hole 0.889: 1(0,17.78)
  round 1.575 hole 0.889: 2(0,15.24) 3(0,12.7) 4(0,10.16) 5(0,7.62) 6(0,5.08) 7(0,2.54) 8(0,0)
OLED-TH_L27.8-W27.2-P2.54_C9900033791
  round 1.8 hole 1.05: 1(-3.81,0) 2(-1.27,0) 3(1.27,0) 4(3.81,0)
PH2.0-6
  round 1.27 hole 0.767x0.762: 1(5.002,0) 2(2.999,0) 3(1.001,0) 4(-1.001,0) 5(-2.999,0) 6(-4.998,0)
SW-TH_3P-P4.70_L11.1-W12.7
  rect 2.5x3 hole 1.8: 1(-4.7,0)
  round 3 hole 1.8: 2(0,0) 3(4.7,0)
SW-TH_4P-L6.0-W6.0-P4.50-LS6.5
  round 1.8 hole 1.2: 1(-3.25,2.25) 2(3.25,2.25) 3(-3.25,-2.25) 4(3.25,-2.25)
SW-TH_SS-23D07-GXXX
  round 1.6 hole 1: 1(-4,-1.25) 2(0,-1.25) 3(2,-1.25) 4(4,-1.25) 5(4,1.25) 6(2,1.25) 7(0,1.25) 8(-4,1.25)
TB6612模块
  round 1.575 hole 0.889x0.914: 1(0,17.78) 2(0,15.24) 3(0,12.7) 4(0,10.16) 5(0,7.62) 6(0,5.08) 7(0,2.54) 8(0,0)
  round 1.575 hole 0.889: 9(15.101,0) 10(15.101,2.54) 11(15.101,5.08) 12(15.101,7.62) 13(15.101,10.16) 14(15.101,12.7) 15(15.101,15.24) 16(15.101,17.78)
嘉立创天猛星
  rect 1.8x1.575 hole 1.1: 1(-19.189,24.09) 60(16.37,-24.09)
  round 1.8 hole 1.1: 2(-19.189,21.549) 3(-19.189,19.009) 4(-19.189,16.47) 5(-19.189,13.93) 6(-19.189,11.389) 7(-19.189,8.85) 8(-19.189,6.309) 9(-19.189,3.769) 10(-19.189,1.23) 11(-19.189,-1.31) 12(-19.189,-3.85) 13(-19.189,-6.391) 14(-19.189,-8.931) 15(-19.189,-11.47) 16(-19.189,-14.011) 17(-19.189,-16.55) 18(-19.189,-19.09) 19(-19.189,-21.631) 20(-19.189,-24.171) 21(-16.649,24.09) 22(-16.649,21.549) 23(-16.649,19.009) 24(-16.649,16.47) 25(-16.649,13.93) 26(-16.649,11.389) 27(-16.649,8.85) 28(-16.649,6.309) 29(-16.649,3.769) 30(-16.649,1.23) 31(-16.649,-1.31) 32(-16.649,-3.85) 33(-16.649,-6.391) 34(-16.649,-8.931) 35(-16.649,-11.47) 36(-16.649,-14.011) 37(-16.649,-16.55) 38(-16.649,-19.09) 39(-16.649,-21.631) 40(-16.649,-24.171) 41(16.37,24.171) 42(16.37,21.631) 43(16.37,19.09) 44(16.37,16.55) 45(16.37,14.011) 46(16.37,11.47) 47(16.37,8.931) 48(16.37,6.391) 49(16.37,3.85) 50(16.37,1.31) 51(16.37,-1.23) 52(16.37,-3.769) 53(16.37,-6.309) 54(16.37,-8.85) 55(16.37,-11.389) 56(16.37,-13.93) 57(16.37,-16.47) 58(16.37,-19.009) 59(16.37,-21.549) 61(18.91,24.171) 62(18.91,21.631) 63(18.91,19.09) 64(18.91,16.55) 65(18.91,14.011) 66(18.91,11.47) 67(18.91,8.931) 68(18.91,6.391) 69(18.91,3.85) 70(18.91,1.31) 71(18.91,-1.23) 72(18.91,-3.769) 73(18.91,-6.309) 74(18.91,-8.85) 75(18.91,-11.389) 76(18.91,-13.93) 77(18.91,-16.47) 78(18.91,-19.009) 79(18.91,-21.549) 80(18.91,-24.09)

## Nets
As in the schematic.

Pads without a net: P5 5 6 7 8; SW1 3

## Via types
v1: diameter 0.61, hole 0.305, Top Layer to Bottom Layer, 237 vias

## Routing (per net, layer and track width the routed paths; a pad name or vN(x,y) marks a point on that pad's centre or on a via; arc(x,y) is an arc through that point)
+3.3V: length 225.4
  Top Layer w0.254: v1(75.31,43.05) 77.09,44.83 77.09,48.39 78.23,49.53 81.39,49.53 U7.71 ; U7.79 81.35,31.62 78.99,31.62 76.71,29.34 v1(74.17,29.34) ; CN3.6 58.93,0.96 79.38,0.96 CN4.6 ; 47.09,30.31 49.44,30.31 v1(52.07,27.69) ; 47.09,30.31 U7.39 ; 47.09,30.31 52.12,25.27 v1(52.12,7.11) ; U7.39 49.15,32.45 49.15,49.66 48.17,50.63 U7.31 ; U7.39 45.79,29.08 41.4,29.08 40.18,30.3 U34.22 40,28.85 40,19.94 29.84,9.78 21.34,9.78 H5.1 ; v1(65.15,29.46) 62.61,32 v1(60.58,32) ; v1(56.39,31.75) 57.91,30.23 v1(58.17,30.23)
  Bottom Layer w0.254: v1(65.15,29.46) 74.04,29.46 v1(74.17,29.34) 74.17,41.91 v1(75.31,43.05) ; v1(60.58,32) 59.94,32 v1(58.17,30.23) ; U7.79 85.38,30.39 86.61,31.62 89.69,31.62 U35.22 ; v1(52.07,27.69) 56.13,31.75 v1(56.39,31.75) ; U7.31 45.71,51.94 43.94,51.94 42.62,50.62 U34.30 ; U7.71 86.65,50.71 87.88,51.94 89.69,51.94 U35.30 ; CN3.6 56.96,3.36 55.25,5.08 54.16,5.08 v1(52.12,7.11) ; 56.9,2.67 56.96,2.67
+5V: length 477.4
  Top Layer w0.5: v1(56.26,33.15) 56.26,34.84 57.62,36.19 v1(73.15,36.19) ; 13.33,46.74 13.33,47.75 12.45,48.64 11.3,48.64 ; 13.33,46.74 v1(13.33,42.16) ; 13.33,46.74 U2.2 ; P2.8 P2.7 P2.6 P2.5 P2.4 P2.3 P2.2 P2.1 ; P2.1 63.5,94.74 H1.1 61.72,98.3 46.25,98.3 ; P2.1 64.26,90.93 61.72,93.47 57.28,93.47 U31.6 ; U20.1 46.25,96.82 46.25,98.3 ; v1(16.76,58.67) 11.3,53.21 11.3,48.64 ; 46.25,98.3 36.7,98.3 U17.4 21.08,96.52 18.29,93.73 U27.2 16.64,90.17 16.64,84.28 13.51,81.15 6.35,81.15 0.76,75.56 0.76,64.06 U14.5 3.43,61.39 3.43,47.62 3.99,47.07 U23.5 6.43,47.07 8,48.64 11.3,48.64 ; 96.77,36.07 99.06,33.78 99.06,15.49 U21.4 97.54,19.51 96.27,20.78 96.27,24.64 95.02,25.89 SW8.7 ; U35.21 93.47,25.3 93.47,23.11 94.55,22.03 SW8.8 ; U7.80 79.49,24.76 75.18,24.76 73.15,26.8 v1(73.15,34.04) ; v1(69.47,42.42) v1(69.47,48.01) ; U4.3 24.26,27.31 P5.1 ; 91.26,27.76 92.96,29.46 92.96,31.37 94.87,33.27 94.87,40.26 98.3,43.69 v1(98.3,50.93)
  Top Layer w1: U4.3 U4.3
  Bottom Layer w0.254: U35.29 89.75,49.34 86.55,49.34 85.38,48.17 U7.72 81.3,49.45 76.28,49.45 74.93,48.09 U7.32 47.02,48.11 45.72,49.4 39.88,49.4 U34.29
  Bottom Layer w0.5: v1(73.15,34.04) v1(73.15,36.19) 73.15,41.28 72.01,42.42 v1(69.47,42.42) ; U13.5 96.39,70.31 96.39,88.01 93.47,90.93 P2.8 ; v1(16.76,58.67) 18.54,60.45 U2.13 ; v1(98.3,50.93) 97.7,51.53 U22.5 93.75,51.53 92.96,50.74 92.96,49.15 91.9,48.08 U35.29 ; U34.21 38.56,27.13 ; 38.56,27.13 38.56,27.06 40.59,25.02 45.09,25.02 47.02,26.95 U7.40 50.89,27.77 v1(56.26,33.15) ; 38.56,27.13 36.96,25.53 26.03,25.53 U4.3 ; U4.3 13.33,40.77 v1(13.33,42.16) ; U7.80 84.01,26.42 89.66,26.42 U35.21
+12V: length 332.4
  Top Layer w1: U2.1 10.92,35.31 U4.2 U4.2 8.25,24.76 8.25,19.05 5.33,16.13 5.33,8 SW1.1 ; v1(24,74.04) 26.92,76.96 v1(26.92,89.92)
  Bottom Layer w1: 86.35,3.31 83.44,6.22 83.44,17.36 85.61,19.53 97.64,19.53 99.06,20.96 99.06,24.49 SW8.2 ; P3.8 P3.7 P3.6 P3.5 P3.4 P3.3 P3.2 P3.1 65.66,98.68 29.46,98.68 26.92,96.14 v1(26.92,89.92) ; CN3.8 63.87,1.02 84.96,1.02 86.35,2.4 CN4.8 ; v1(24,74.04) 13.72,74.04 7.37,67.69 7.37,57.91 10.92,54.36 U2.1 ; SW8.1 95.68,23.88 9.14,23.88 U4.2
AGND: length 9.9
  Bottom Layer w0.254: U7.18 44.24,32.85 43.69,33.4 43.18,33.4 41.4,31.62 37.24,31.62 U34.18
GND: length 24.7
  Top Layer w0.254: U35.11 89.1,50.62 90.3,51.82 92.33,51.82 92.58,52.07 92.58,54.1 v1(92.84,54.36)
  Top Layer w0.5: 94.74,27.76 SW8.6
  Bottom Layer w0.254: U13.2 97.58,62.79 96.27,61.47 96.27,57.78 v1(92.84,54.36) ; SW4.3 SW4.4
  vias: v1(5.44,89.32) v1(5.44,84.24) v1(5.44,79.16) v1(5.44,71.48) v1(5.44,66.4) v1(5.44,35.92) v1(5.44,25.76) v1(5.44,5.44) v1(10.52,94.4) v1(10.52,89.32) v1(10.52,84.24) v1(10.52,76.56) v1(10.52,66.4) v1(10.52,30.84) v1(10.52,25.76) v1(10.52,20.68) v1(10.52,15.6) v1(15.6,94.4) v1(15.6,89.32) v1(15.6,84.24) v1(15.6,76.56) v1(15.6,71.48) v1(15.6,66.4) v1(15.6,56.24) v1(15.6,51.16) v1(15.6,41) v1(15.6,35.92) v1(15.6,30.84) v1(15.6,25.76) v1(15.6,20.68) v1(20.68,89.32) v1(20.68,84.24) v1(20.68,76.56) v1(20.68,71.48) v1(20.68,66.4) v1(20.68,51.16) v1(20.68,41) v1(20.68,35.92) v1(20.68,30.84) v1(20.68,25.76) v1(20.68,20.68) v1(20.68,15.6) v1(20.68,5.44) v1(25.76,94.4) v1(25.76,89.32) v1(25.76,84.24) v1(25.76,71.48) v1(25.76,66.4) v1(25.76,35.92) v1(25.76,20.68) v1(25.76,15.6) v1(25.76,10.52) v1(25.76,5.44) v1(30.84,94.4) v1(30.84,89.32) v1(30.84,84.24) v1(30.84,76.56) v1(30.84,71.48) v1(30.84,66.4) v1(30.84,41) v1(30.84,35.92) v1(30.84,30.84) v1(30.84,20.68) v1(30.84,15.6) v1(30.84,5.44) v1(35.92,94.4) v1(35.92,89.32) v1(35.92,84.24) v1(35.92,10.52) v1(41,10.52) v1(41,5.44) v1(46.08,84.24) v1(46.08,20.68) v1(46.08,15.6) v1(46.08,10.52) v1(46.08,5.44) v1(50.5,53.66) v1(51.16,94.4) v1(51.16,20.68) v1(51.89,30.71) v1(54.33,6.95) v1(56.24,94.4) v1(58.14,79.5) v1(60.66,53.66) v1(61.32,71.48) v1(65.75,53.66) v1(68.3,79.5) v1(68.83,33.13) v1(68.83,28.05) v1(70.82,53.66) v1(71.48,66.4) v1(73.3,18.69) v1(73.38,79.5) v1(73.91,43.29) v1(73.91,28.05) v1(75.91,53.66) v1(76.56,89.32) v1(76.56,71.48) v1(76.56,66.4) v1(78.38,18.69) v1(81.64,89.32) v1(86.72,94.4) v1(86.72,89.32) v1(89.38,10.52) v1(89.38,5.44) v1(91.8,94.4) v1(91.8,89.32) v1(94.46,15.6) v1(94.46,10.52) v1(96.88,89.32) v1(99.31,48.37) v1(99.31,43.29) v1(99.31,38.21)
VCC: length 19
  Top Layer w1: SW1.2 15.75,5.59 15.75,11.93 DC1.1 17.64,17.53 H2.2
AO1: length 97.8
  Top Layer w0.254: U22.1 97.28,47.81 97.28,54.48 v1(98.04,55.25)
  Bottom Layer w0.254: U22.1 93.79,44.32 32.89,44.32 31.88,45.34 31.88,48.01 30.99,48.89 20.57,48.89 U2.4 ; U13.1 98.04,60.66 v1(98.04,55.25)
AO2: length 97.1
  Top Layer w0.254: v1(27.69,51.05) 25.27,51.05 U2.5 ; U22.6 95.38,53.41 95.38,55.63 96.77,57.02 96.77,69.64 U13.6
  Bottom Layer w0.254: v1(27.69,51.05) 30.23,51.05 33.66,54.48 91.57,54.48 93.6,52.45 94.42,52.45 U22.6
BO1: length 55.6
  Bottom Layer w0.254: 4.59,53.07 4.42,53.07 2.29,50.93 2.29,44.7 3.81,43.18 22.48,43.18 U2.7 ; 4.59,53.07 U23.1 ; 4.59,53.07 0.76,56.9 0.76,69.52 U14.1
BO2: length 37.9
  Top Layer w0.254: U23.6 3.33,45.57 2.03,46.86 U14.6
  Bottom Layer w0.254: U23.6 6.58,43.94 20.7,43.94 U2.6
CHIP: length 9.5
  Bottom Layer w0.254: U7.38 45.77,34.1 42.99,34.1 41.73,32.84 U34.23
CLK: length 9.5
  Top Layer w0.254: U7.30 45.79,51.94 43.56,51.94 v1(42.42,53.09)
  Bottom Layer w0.254: U34.31 42.34,53.16 v1(42.42,53.09)
DIO: length 9.5
  Bottom Layer w0.254: U7.10 44.03,53.17 42.8,51.94 37.24,51.94 U34.10
PA0: length 79.5
  Top Layer w0.254: P5.4 22.61,15.24 22.61,33.4 24,34.8 28.7,34.8 33.4,39.5 33.4,71.25 35.64,73.48 U34.2
  Bottom Layer w0.254: U34.2 36.27,73.48 37.47,74.68 39.37,74.68 40.51,75.82 42.15,75.82 U7.2
PA1: length 69.7
  Top Layer w0.254: P5.3 34.04,25.91 34.04,69.72 35.25,70.94 U34.3
  Bottom Layer w0.254: U34.3 37.36,69.6 43.18,69.6 44.48,70.89 U7.3
PA2: length 64.4
  Top Layer w0.254: v1(92.84,64.39) 92.71,64.26 92.71,55.5 91.69,54.48 89.79,54.48 U35.10 ; v1(86.74,77.34) 91.69,77.34 92.84,76.2 v1(92.84,66.17) ; v1(77.98,82.3) 77.98,83.52 v1(76.2,85.29)
  Bottom Layer w0.254: U7.50 81.35,51.94 87,51.94 88.21,53.16 U35.10 ; v1(77.98,82.3) 81.79,82.3 v1(86.74,77.34) ; v1(92.84,64.39) v1(92.84,66.17) ; v1(76.2,85.29) 76.89,85.98 81.41,85.98 82.55,87.12 P1.7
PA7: length 74
  Top Layer w0.254: U35.25 93.47,40.39 93.47,62.23 95.38,64.14 95.38,78.49 90.55,83.31 81.41,83.31 77.47,87.25 P1.5
  Bottom Layer w0.254: U35.25 89.69,39.24 87.38,39.24 86.15,38.01 U7.76
PA8: length 105
  Top Layer w0.254: v1(87.83,25.67) 87.83,23.67 89.53,21.97 89.53,14.35 U21.1 ; v1(77.09,39.24) 76.33,40 57.02,40 56.64,40.39 v1(56.64,65.91)
  Bottom Layer w0.254: U34.4 37.36,67.06 42.29,67.06 43.65,68.41 U7.4 45.13,68.41 46.35,67.18 55.37,67.18 v1(56.64,65.91) ; v1(87.83,25.67) 78.98,25.67 77.47,27.18 77.47,38.86 v1(77.09,39.24)
PA9: length 105.6
  Top Layer w0.254: v1(90.81,25.09) 92.46,23.44 U21.2 ; v1(42.04,67.94) 44.11,65.87 U7.5 45,65.87 46.23,64.64 48.39,64.64 48.96,64.07 ; U34.5 36.89,65.86 38.07,67.04 39.48,67.04 v1(40.26,67.82) ; v1(75.82,38.61) 75.56,38.86 56.51,38.86 55.63,39.75 v1(55.63,63.37)
  Bottom Layer w0.254: v1(75.82,38.61) 76.71,37.72 76.71,26.67 78.36,25.02 90.74,25.02 v1(90.81,25.09) ; v1(40.26,67.82) 40.39,67.94 v1(42.04,67.94) ; v1(48.95,64.06) 54.94,64.06 v1(55.63,63.37)
PA10: length 88.5
  Top Layer w0.254: v1(53.72,63.33) 54.74,62.32 v1(54.74,40.64) ; v1(54.74,35.61) 54.74,25.27 55.37,24.64 55.37,11.68 56.39,10.67 61.34,10.67 66.68,5.33 69.47,5.33 71.35,3.46 CN4.2 ; U7.26 46.51,63.33 45.2,64.64 43.18,64.64 v1(42.42,63.88)
  Bottom Layer w0.254: U34.35 41.86,63.32 v1(42.42,63.88) ; U7.26 v1(53.72,63.33) ; v1(54.74,40.64) v1(54.74,35.61)
PA11: length 86
  Top Layer w0.254: CN4.1 65.02,2.92 63.37,4.57 57.66,4.57 54.74,7.5 54.74,24.26 53.09,25.91 53.09,35.18 v1(53.47,35.56) ; v1(53.34,40.77) 53.34,60.33 v1(52.96,60.71) ; v1(42.67,60.45) 43.56,59.56 45.97,59.56 47.02,60.6 U7.27
  Bottom Layer w0.254: v1(53.34,40.77) 53.47,40.64 v1(53.47,35.56) ; U34.34 39.14,60.2 42.42,60.2 v1(42.67,60.45) ; U7.27 52.87,60.79 v1(52.96,60.71)
PA12: length 42.4
  Top Layer w0.254: U34.15 37.24,39.24 39.62,39.24 v1(40.51,40.13) ; v1(30.86,42.16) 30.86,57.66 29.46,59.06 23.99,59.06 U2.12
  Bottom Layer w0.254: v1(30.86,42.16) 32.56,40.46 U34.15 ; v1(40.51,40.13) 44.13,40.13 U7.15
PA13: length 42.4
  Top Layer w0.254: U2.11 24.65,61.96 25.72,60.9 29.27,60.9 32.26,57.91 v1(32.26,42.55)
  Bottom Layer w0.254: U7.35 45.71,41.78 43.69,41.78 42.8,40.89 38.99,40.89 U34.26 38.15,40.46 36.83,41.78 33.02,41.78 v1(32.26,42.55)
PA14: length 75.7
  Top Layer w0.254: v1(17.91,64.64) 16,62.74 U2.14 ; U7.46 80.81,63.41 82.04,64.64 87.15,64.64 U35.6
  Bottom Layer w0.254: v1(17.91,64.64) 78.93,64.64 80.04,63.54 U7.46
PA15: length 80.4
  Top Layer w0.254: U35.35 89.79,62.1 87.5,62.1 86.19,63.41 U7.66
  Bottom Layer w0.254: U2.15 15,63.5 33.4,63.5 34.8,62.1 81.26,62.1 U7.66
PA16: length 82.2
  Top Layer w0.254: U35.7 87.68,60.78 86.36,62.1 81.79,62.1 80.56,60.87 U7.47 76.37,60.87 v1(72.52,57.02)
  Bottom Layer w0.254: U2.16 15.86,57.02 v1(72.52,57.02)
PA17: length 67.4
  Top Layer w0.254: U35.34 89.79,59.56 87.88,59.56 86.57,60.87 U7.67
  Bottom Layer w0.254: U2.10 28.56,59.56 81.26,59.56 U7.67
PA18: length 77.8
  Top Layer w0.254: U35.23 93.98,35.81 93.98,55.88 96.01,57.91 96.01,78.87 90.04,84.84 82.17,84.84 80.01,87 P1.6
  Bottom Layer w0.254: U35.23 89.69,34.16 86.36,34.16 85.13,32.93 U7.78
PA21: length 146
  Top Layer w0.254: P1.1 67.31,86.74 76.07,77.98 91.95,77.98 93.98,75.95 v1(93.98,68.96) ; U7.69 83.65,55.79 85.6,53.85 85.6,21.46 83.69,19.56 61.98,19.56 v1(57.53,15.11) ; v1(52.96,10.41) 52.96,3.92 CN3.4
  Bottom Layer w0.254: U7.69 86.27,55.79 87.38,56.9 89.94,56.9 91.01,55.83 U35.32 93.98,58.67 v1(93.98,68.96) ; v1(57.53,15.11) 55.25,15.11 52.96,12.83 v1(52.96,10.41)
PA22: length 190.4
  Top Layer w0.254: v1(57.53,41.78) 57.53,65.02 60.58,68.07 76.45,68.07 77.4,67.13 77.4,65.48 78.23,64.64 81.26,64.64 U7.65 85.26,65.95 86.49,67.18 89.69,67.18 U35.36 91.59,65.28 93.47,65.28 94.74,66.55 94.74,78.23 90.81,82.17 80.65,82.17 P1.4 ; CN3.1 44.44,2.95 44.44,20.31 49.4,25.27 v1(49.66,25.27)
  Bottom Layer w0.254: v1(49.66,25.27) 51.69,25.27 58.55,32.13 58.55,40.77 v1(57.53,41.78) ; P1.4 73.41,89.41 41.28,89.41 40,90.68 40,96.52
PA23: length 9.5
  Top Layer w0.254: U35.31 90.37,53.16 89.15,51.94 87.67,51.94 v1(86.49,53.13)
  Bottom Layer w0.254: U7.70 82.7,53.13 v1(86.49,53.13)
PA24: length 9.6
  Top Layer w0.254: U7.63 86.27,71.03 87.38,72.14 90.17,72.14 91.01,71.3 U35.38
PA25: length 9.5
  Bottom Layer w0.254: U7.43 80.56,71.03 81.79,72.26 86.74,72.26 88.06,70.94 U35.3
PA26: length 121.1
  Top Layer w0.254: 5.33,62.5 v1(5.33,62.48) 5.33,54.99 6.6,53.72 6.6,51.72 U23.3
  Bottom Layer w0.254: U35.39 89.62,74.87 84.65,74.87 83.35,73.57 U7.62 81.35,74.8 53.59,74.8 52.2,76.2 52.2,77.34 50.11,79.43 8.94,79.43 3.94,74.42 3.94,68.69 U14.3 5.33,63.48 v1(5.33,62.48)
PA27: length 118.5
  Top Layer w0.254: U7.42 80.73,73.57 81.91,72.39 86.74,72.39 87.83,73.48 U35.2 ; U23.4 7.37,50.98 7.37,54.23 6.1,55.5 6.1,63.88 5.19,64.78 U14.4 9.65,72.41 9.65,74.8 13.21,78.36 v1(14.61,78.36)
  Bottom Layer w0.254: v1(14.61,78.36) 14.62,78.36 14.67,78.41 49.86,78.41 51.18,77.09 51.18,75.82 53.43,73.57 U7.42
PA28: length 104.5
  Top Layer w0.254: v1(48.77,82.42) 48.26,82.42 45.72,79.88 45.72,74.79 U7.22 45.79,72.26 39.88,72.26 38.66,73.48 U34.39
  Bottom Layer w0.254: U22.3 97.68,48.53 99.19,50.04 99.19,63.75 98.16,64.78 U13.3 94.74,67.96 94.74,78.99 90.3,83.44 49.78,83.44 v1(48.77,82.42)
PA29: length 54.1
  Top Layer w0.254: v1(62.61,18.29) 64.77,16.13 v1(64.77,16) ; v1(57.43,34.29) 59.69,32.03 v1(59.69,21.21)
  Bottom Layer w0.254: 75.99,13.3 SW2.1 66.79,16 v1(64.77,16) ; U34.24 40.21,35.38 41.53,36.7 45.34,36.7 46.65,35.39 U7.37 48.12,34.29 v1(57.43,34.29) ; v1(62.61,18.29) v1(59.69,21.21)
PA30: length 52.9
  Top Layer w0.254: v1(84.25,41.66) 84.25,25.45 82.17,23.37 v1(82.17,21.46)
  Bottom Layer w0.254: v1(82.17,21.46) 82.17,7.24 80.77,5.84 78.49,5.84 76.35,3.7 CN4.4 ; U35.14 87.71,43 86.36,41.66 v1(84.25,41.66) 84.18,41.73 81.4,41.73 U7.54
PA31: length 107.9
  Top Layer w0.254: v1(47.5,80.14) 47.5,78.49 48.77,77.22 48.77,72.7 U7.23 45.79,69.72 42.93,69.72 42.34,70.31 42.34,71.45 42.16,71.63 39.88,71.63 39.19,70.94 U34.38 ; U22.4 95.24,50.03 96.52,51.31 96.52,55.5 99.19,58.17 99.19,65.52 U13.4
  Bottom Layer w0.254: U13.4 95.38,69.33 95.38,80.77 91.69,84.45 49.53,84.45 47.5,82.42 v1(47.5,80.14)
PB0: length 9.5
  Bottom Layer w0.254: U35.15 87.45,40.46 86.23,39.24 81.35,39.24 U7.55
PB1: length 9.5
  Bottom Layer w0.254: U35.26 89.69,41.78 87.5,41.78 86.27,40.55 U7.75
PB2: length 60
  Top Layer w0.254: v1(40.77,58.8) 40.77,57.78 40,57.02 37.24,57.02 U34.8 ; v1(28.45,58.04) 21.46,58.04 19.81,59.69 19.81,90.81 U27.3
  Bottom Layer w0.254: v1(40.77,58.8) 43.93,58.8 U7.8 ; U34.8 35.81,58.04 v1(28.45,58.04)
PB3: length 69.4
  Top Layer w0.254: U27.4 23.37,92.58 22.1,93.85 20.45,93.85 19.47,92.87 19.47,91.09 18.8,90.42 18.8,64.14 17.27,62.61 17.27,60.71 22.86,55.12 v1(28.57,55.12) ; v1(40.51,55.25) 39.75,54.48 37.24,54.48 U34.9
  Bottom Layer w0.254: v1(40.51,55.25) 44.01,55.25 U7.9 ; U34.9 35.43,55.12 v1(28.57,55.12)
PB4: length 117.5
  Top Layer w0.254: v1(63.25,26.42) 63.25,21.08 63.82,20.51 v1(79.5,20.51) ; v1(42.42,68.71) 43.94,67.18 46.1,67.18 47.02,68.1 U7.24 ; v1(64.26,42.16) 64.26,56.64 65.02,57.4 69.09,57.4 72.26,60.58 72.26,63.5 v1(69.85,65.91) ; SW5.1 SW5.2
  Bottom Layer w0.254: v1(42.42,68.71) 38.86,68.71 U34.37 ; SW5.1 81.15,15.41 81.15,18.86 v1(79.5,20.51) ; v1(63.25,26.42) 63.25,29.72 64.26,30.73 v1(64.26,42.16) ; U7.24 56.81,68.41 59.31,65.91 v1(69.85,65.91)
PB5: length 9.8
  Bottom Layer w0.254: U7.25 46.78,65.87 45.47,67.18 43.56,67.18 41.91,65.53 38.89,65.53 U34.36
PB6: length 10
  Top Layer w0.254: U34.13 37.24,44.32 40.39,44.32 40.57,44.5 v1(40.57,45.34)
  Bottom Layer w0.254: U7.13 40.78,45.55 v1(40.57,45.34)
PB7: length 73.5
  Top Layer w0.254: v1(76.45,76.33) 76.2,76.33 v1(72.14,72.26) ; P1.3 72.39,86.23 v1(76.33,82.3) ; v1(59.94,46.36) 59.94,60.96 v1(66.29,67.31)
  Bottom Layer w0.254: v1(76.33,82.3) 76.45,82.17 v1(76.45,76.33) ; v1(72.14,72.26) 71.25,72.26 v1(66.29,67.31) ; U34.28 39.06,45.54 40.39,46.86 45.71,46.86 U7.33 59.14,45.55 v1(59.94,46.36)
PB8: length 9.5
  Bottom Layer w0.254: U34.14 36.63,43 37.85,41.78 42.42,41.78 43.65,43.01 U7.14
PB9: length 9.8
  Top Layer w0.254: U7.34 47.02,43.41 46.1,44.32 43.81,44.32 v1(42.49,43)
  Bottom Layer w0.254: U34.27 v1(42.49,43)
PB10: length 92
  Top Layer w0.254: U31.3 52.07,87.76 52.07,39.88 54.23,37.72 79.74,37.72 U7.56
  Bottom Layer w0.254: U35.16 87.2,37.92 86.11,36.83 81.22,36.83 U7.56
PB11: length 9.5
  Bottom Layer w0.254: U7.57 81.35,34.16 85.34,34.16 86.56,35.38 U35.17
PB12: length 47.3
  Top Layer w0.254: v1(42.29,57.91) 43.18,57.02 45.97,57.02 47.02,58.06 U7.28 50.04,61.28 50.04,84.71 U31.1
  Bottom Layer w0.254: v1(42.29,57.91) 39.24,57.91 38.91,58.24 U34.33
PB13: length 50.4
  Top Layer w0.254: v1(42.29,56.13) 42.8,55.63 42.8,54.66 42.98,54.48 45.79,54.48 U7.29 50.93,59.62 50.93,86.36 U31.2
  Bottom Layer w0.254: U34.32 38.99,56.13 v1(42.29,56.13)
PB14: length 9.5
  Bottom Layer w0.254: U7.77 85.64,35.47 86.87,36.7 89.69,36.7 U35.24
PB15: length 115.5
  Top Layer w0.254: v1(41.66,30.61) 41.58,30.68 41.58,61.29 40.78,62.09 37.25,62.09 U34.6 37.34,64.64 40.64,64.64 ; 42.54,96.52 40.64,94.61 v1(40.64,74.68) ; 40.64,64.64 40.64,64.01 41.78,62.86 44.01,62.86 U7.6 ; 40.64,64.64 41.4,65.41 41.4,70.1 v1(40.64,70.87) ; v1(41.66,26.03) 41.66,25.91 42.49,25.07 42.49,1.96 43.56,0.89 44.93,0.89 CN3.2
  Bottom Layer w0.254: v1(41.66,26.03) v1(41.66,30.61) ; v1(40.64,74.68) v1(40.64,70.87)
PB16: length 76.5
  Top Layer w0.254: v1(31.62,61.72) 31.62,83.44 v1(34.93,86.74) ; v1(60.96,88.27) v1(60.96,91.82) ; v1(40.39,61.21) 40.39,60.2 39.75,59.56 37.24,59.56 U34.7
  Bottom Layer w0.254: v1(40.39,61.21) 44.05,61.21 U7.7 ; v1(31.62,61.72) 32.56,60.78 U34.7 ; v1(60.96,88.27) 59.69,87 35.18,87 v1(34.93,86.74) ; v1(60.96,91.82) H1.2
PB17: length 9.5
  Bottom Layer w0.254: U35.8 88.42,58.29 87,58.29 85.72,57.02 81.35,57.02 U7.48
PB18: length 75.9
  Top Layer w0.254: SW3.1 SW3.2 v1(66.43,18.67) ; v1(66.55,41.28) 66.55,54.61 67.18,55.25 74.68,55.25 78.99,59.56 81.35,59.56 U7.68 ; v1(66.43,21.46) v1(66.43,34.29)
  Bottom Layer w0.254: v1(66.55,41.28) 66.43,41.16 v1(66.43,34.29) ; v1(66.43,18.67) v1(66.43,21.46) ; U35.33 90.86,58.24 89.53,59.56 83.81,59.56 U7.68
PB19: length 96.9
  Top Layer w0.254: v1(53.72,20.7) 53.72,4.44 54.46,3.7 CN3.5 ; v1(84.2,22.22) 84.84,22.86 84.84,53.59 83.95,54.48 81.35,54.48 U7.49 81.26,57.02 87.15,57.02 U35.9 ; 53.85,3.28 54.46,2.67
  Bottom Layer w0.254: v1(84.2,22.22) 55.25,22.22 v1(53.72,20.7)
PB20: length 101.8
  Top Layer w0.254: P1.2 69.85,86.23 76.96,79.12 v1(90.68,79.12) ; U7.45 77.16,68.83 58.17,68.83 53.09,73.91 U31.5
  Bottom Layer w0.254: v1(90.68,79.12) 92.07,79.12 93.09,78.11 93.09,67.56 92.71,67.18 89.92,67.18 88.59,65.86 U35.5 87.15,67.18 81.26,67.18 U7.45
PB21: length 89.4
  Top Layer w0.254: v1(80.14,17.53) 86.23,17.53 86.61,17.91 86.61,43.69 U35.13
  Bottom Layer w0.254: U35.13 88.47,45.77 87.38,46.86 81.26,46.86 U7.53 ; v1(80.14,17.53) 51.82,17.53 48.77,14.48 48.77,4.51 49.73,3.55 49.73,3.19 CN3.3
PB22: length 64.3
  Top Layer w0.254: v1(71.75,34.42) 71.88,34.29 v1(71.88,21.34) ; v1(71.75,18.67) 73.03,17.4 73.03,8.74 CN4.5 ; v1(71.75,40.64) 72.77,41.66 76.2,41.66 78.87,44.32 81.26,44.32 U7.73 ; U35.28 89.69,46.86 87.59,46.86 v1(86.36,45.63)
  Bottom Layer w0.254: v1(71.88,21.34) 71.88,18.8 v1(71.75,18.67) ; U7.73 v1(86.36,45.63) ; 78.72,2.67 78.72,3.79 ; v1(71.75,34.42) 71.72,34.46 71.72,40.6 v1(71.75,40.64)
PB23: length 68.6
  Top Layer w0.254: v1(49.78,36.7) 55.12,36.7 55.5,36.32 55.5,28.96 57.53,26.92 v1(57.53,16.64)
  Bottom Layer w0.254: v1(57.53,16.64) 58.42,15.75 58.42,8 59.94,6.48 70.87,6.48 73.85,3.5 CN4.3 ; v1(49.78,36.7) 46.35,36.7 45.13,37.93 U7.16 43.16,39.24 37.34,39.24 U34.16
PB24: length 63.3
  Top Layer w0.254: U7.64 81.35,69.72 59.44,69.72 54.36,74.8 54.36,93.09 53.97,93.47 52.2,93.47 U31.4
  Bottom Layer w0.254: U7.64 85.51,68.49 86.74,69.72 89.69,69.72 U35.37
PB25: length 154.7
  Top Layer w0.254: v1(84.71,69.72) 86.03,68.4 U35.4 ; v1(62.1,42.42) 62.1,61.21 v1(68.2,67.31) ; v1(56.39,25.65) v1(56.39,16.26) 56.39,14.22 56.88,13.74 SW4.2 ; v1(46.74,85.34) 46.74,85.47 v1(42.16,90.04) ; v1(77.6,70.56) 77.49,70.66 67.51,70.66 65.41,72.77 65.41,83.69 v1(63.5,85.6)
  Bottom Layer w0.254: v1(42.16,90.04) 41.1,91.11 41.1,93.29 41.28,93.47 46.04,93.47 U20.2 ; v1(63.5,85.6) 63.25,85.34 v1(46.74,85.34) ; U7.44 78.85,67.31 v1(68.2,67.31) ; U7.44 77.97,70.56 v1(77.6,70.56) ; U7.44 81.26,69.72 v1(84.71,69.72) ; v1(62.1,42.42) 62.1,31.37 v1(56.39,25.65) ; SW4.1 53.33,16.26 v1(56.39,16.26)
PB26: length 119.5
  Top Layer w0.254: v1(42.42,28.07) 40.89,26.54 40.89,13.37 SW7.1 ; U34.25 v1(40.26,37.92) ; v1(63.37,67.31) 58.55,62.48 v1(58.55,42.8) ; v1(63.37,71.25) 63.37,83.19 v1(56.39,90.17) ; v1(42.8,38.05) 43.87,39.12 45.72,39.12 46.9,37.93 U7.36 45.79,36.7 43.69,36.7 42.8,35.81 v1(42.8,30.86)
  Bottom Layer w0.254: v1(42.42,28.07) 42.8,28.45 v1(42.8,30.86) ; v1(58.55,42.8) 51.88,42.8 U7.36 ; v1(42.8,38.05) 40.39,38.05 v1(40.26,37.92) ; SW7.1 SW7.2 ; U20.3 51.63,95.82 54.36,93.09 54.36,90.55 54.74,90.17 v1(56.39,90.17) ; v1(63.37,67.31) v1(63.37,71.25)
PB27: length 9.5
  Bottom Layer w0.254: U7.17 44.39,35.31 42.16,35.31 41.02,34.16 37.24,34.16 U34.17
RST: length 9.4
  Bottom Layer w0.254: U7.58 81.22,31.75 85.34,31.75 86.44,32.84 U35.18

## Copper pours and planes (outline as drawn; the poured copper is in the pictures)
GND on Top Layer: -33.4,114.94 134.11,114.94 134.11,-19.69 -33.4,-19.69
GND on Bottom Layer: -33.27,114.81 133.99,114.81 133.99,-19.81 -33.27,-19.81
